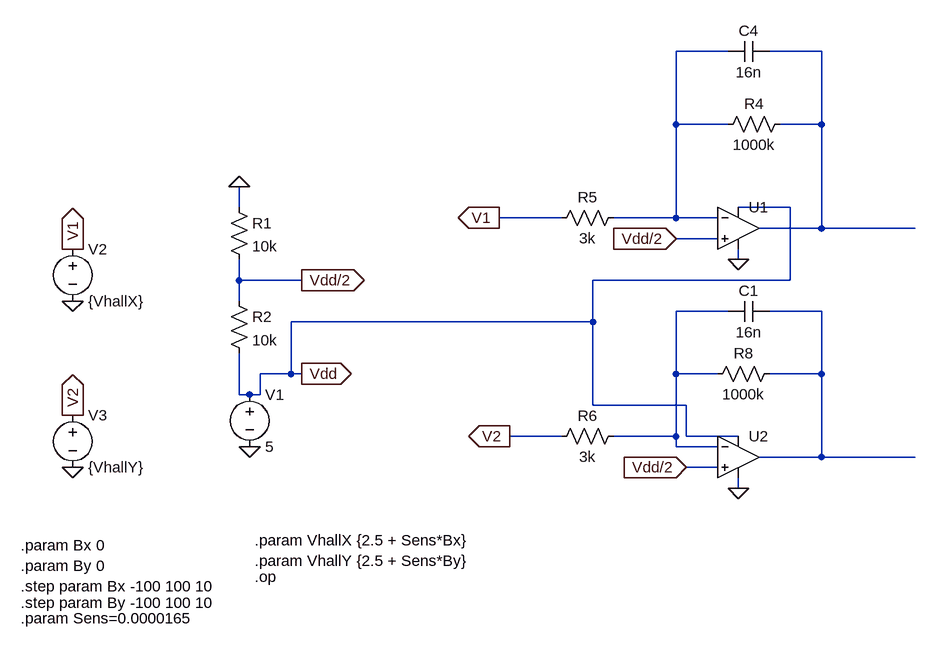
[diagram p0: schematic exp_3.asc]
exp_3.asc, the LTspice schematic file:
Version 4.1
SHEET 1 880 680
WIRE -448 -816 -528 -816
WIRE -304 -816 -384 -816
WIRE -528 -704 -528 -816
WIRE -448 -704 -528 -704
WIRE -304 -704 -304 -816
WIRE -304 -704 -368 -704
WIRE -1200 -576 -1200 -608
WIRE -352 -576 -432 -576
WIRE -704 -560 -800 -560
WIRE -528 -560 -528 -704
WIRE -528 -560 -624 -560
WIRE -464 -560 -528 -560
WIRE -304 -544 -304 -704
WIRE -304 -544 -400 -544
WIRE -160 -544 -304 -544
WIRE -464 -528 -528 -528
WIRE -432 -496 -432 -512
WIRE -1200 -464 -1200 -496
WIRE -1104 -464 -1200 -464
WIRE -352 -464 -352 -576
WIRE -352 -464 -656 -464
WIRE -1200 -432 -1200 -464
WIRE -448 -416 -528 -416
WIRE -304 -416 -384 -416
WIRE -656 -400 -656 -464
WIRE -656 -400 -1120 -400
WIRE -1120 -320 -1120 -400
WIRE -1120 -320 -1168 -320
WIRE -1104 -320 -1120 -320
WIRE -528 -320 -528 -416
WIRE -464 -320 -528 -320
WIRE -304 -320 -304 -416
WIRE -304 -320 -384 -320
WIRE -1200 -288 -1200 -352
WIRE -1184 -288 -1200 -288
WIRE -1168 -288 -1168 -320
WIRE -1168 -288 -1184 -288
WIRE -656 -272 -656 -400
WIRE -512 -272 -656 -272
WIRE -704 -224 -784 -224
WIRE -528 -224 -528 -320
WIRE -528 -224 -624 -224
WIRE -512 -224 -512 -272
WIRE -432 -224 -512 -224
WIRE -528 -208 -528 -224
WIRE -464 -208 -528 -208
WIRE -304 -192 -304 -320
WIRE -304 -192 -400 -192
WIRE -160 -192 -304 -192
WIRE -464 -176 -512 -176
WIRE -432 -144 -432 -160
FLAG -1184 -208 0
FLAG -1200 -608 0
FLAG -1104 -320 Vdd
IOPIN -1104 -320 Out
FLAG -1104 -464 Vdd/2
IOPIN -1104 -464 Out
FLAG -1456 -176 0
FLAG -1456 -432 0
FLAG -1456 -512 V1
IOPIN -1456 -512 Out
FLAG -1456 -256 V2
IOPIN -1456 -256 Out
FLAG -800 -560 V1
IOPIN -800 -560 Out
FLAG -784 -224 V2
IOPIN -784 -224 Out
FLAG -528 -528 Vdd/2
IOPIN -528 -528 In
FLAG -512 -176 Vdd/2
IOPIN -512 -176 In
FLAG -432 -496 0
FLAG -432 -144 0
SYMBOL voltage -1184 -304 R0
SYMATTR InstName V1
SYMATTR Value 5
SYMBOL res -1216 -592 R0
SYMATTR InstName R1
SYMATTR Value 10k
SYMBOL res -1216 -448 R0
SYMATTR InstName R2
SYMATTR Value 10k
SYMBOL res -352 -720 R90
WINDOW 0 0 56 VBottom 2
WINDOW 3 32 56 VTop 2
SYMATTR InstName R4
SYMATTR Value 1000k
SYMBOL res -608 -576 R90
WINDOW 0 0 56 VBottom 2
WINDOW 3 32 56 VTop 2
SYMATTR InstName R5
SYMATTR Value 3k
SYMBOL res -608 -240 R90
WINDOW 0 0 56 VBottom 2
WINDOW 3 32 56 VTop 2
SYMATTR InstName R6
SYMATTR Value 3k
SYMBOL res -368 -336 R90
WINDOW 0 0 56 VBottom 2
WINDOW 3 32 56 VTop 2
SYMATTR InstName R8
SYMATTR Value 1000k
SYMBOL cap -384 -432 R90
WINDOW 0 0 32 VBottom 2
WINDOW 3 32 32 VTop 2
SYMATTR InstName C1
SYMATTR Value 16n
SYMBOL cap -384 -832 R90
WINDOW 0 0 32 VBottom 2
WINDOW 3 32 32 VTop 2
SYMATTR InstName C4
SYMATTR Value 16n
SYMBOL voltage -1456 -528 R0
SYMATTR InstName V2
SYMATTR Value {VhallX}
SYMBOL voltage -1456 -272 R0
SYMATTR InstName V3
SYMATTR Value {VhallY}
SYMBOL OpAmps\\UniversalOpAmp2 -432 -544 R0
SYMATTR InstName U1
SYMBOL OpAmps\\UniversalOpAmp2 -432 -192 R0
SYMATTR InstName U2
TEXT -1176 -8 Left 2 !.op
TEXT -1536 56 Left 2 !.param Sens=0.0000165
TEXT -1176 -64 Left 2 !.param VhallX {2.5 + Sens*Bx}\n.param VhallY {2.5 + Sens*By}
TEXT -1536 -56 Left 2 !.param Bx 0\n.param By 0\n.step param Bx -100 100 10
TEXT -1536 32 Left 2 !.step param By -100 100 10

The netlist it stands for:
* exp_3.asc
V1 Vdd 0 5
R1 0 Vdd/2 10k
R2 Vdd/2 Vdd 10k
R4 N002 N001 1000k
R5 N001 V1 3k
R6 N003 V2 3k
R8 N004 N003 1000k
C1 N004 N003 16n
C4 N002 N001 16n
V2 V1 0 {VhallX}
V3 V2 0 {VhallY}
X§U1 Vdd/2 N001 Vdd 0 N002 level2 Avol=1Meg GBW=10Meg Slew=10Meg Ilimit=25m Rail=0 Vos=0 En=0 Enk=0 In=0 Ink=0 Rin=500Meg  ; pins In+ In- V+ V- OUT
X§U2 Vdd/2 N003 Vdd 0 N004 level2 Avol=1Meg GBW=10Meg Slew=10Meg Ilimit=25m Rail=0 Vos=0 En=0 Enk=0 In=0 Ink=0 Rin=500Meg  ; pins In+ In- V+ V- OUT
.op
.param Sens=0.0000165
.param VhallX {2.5 + Sens*Bx}
.param VhallY {2.5 + Sens*By}
.param Bx 0
.param By 0
.step param Bx -100 100 10
.step param By -100 100 10
.lib UniversalOpAmp2.lib
.backanno
.end